# EAGLE design design (EAGLE 9.6.2)
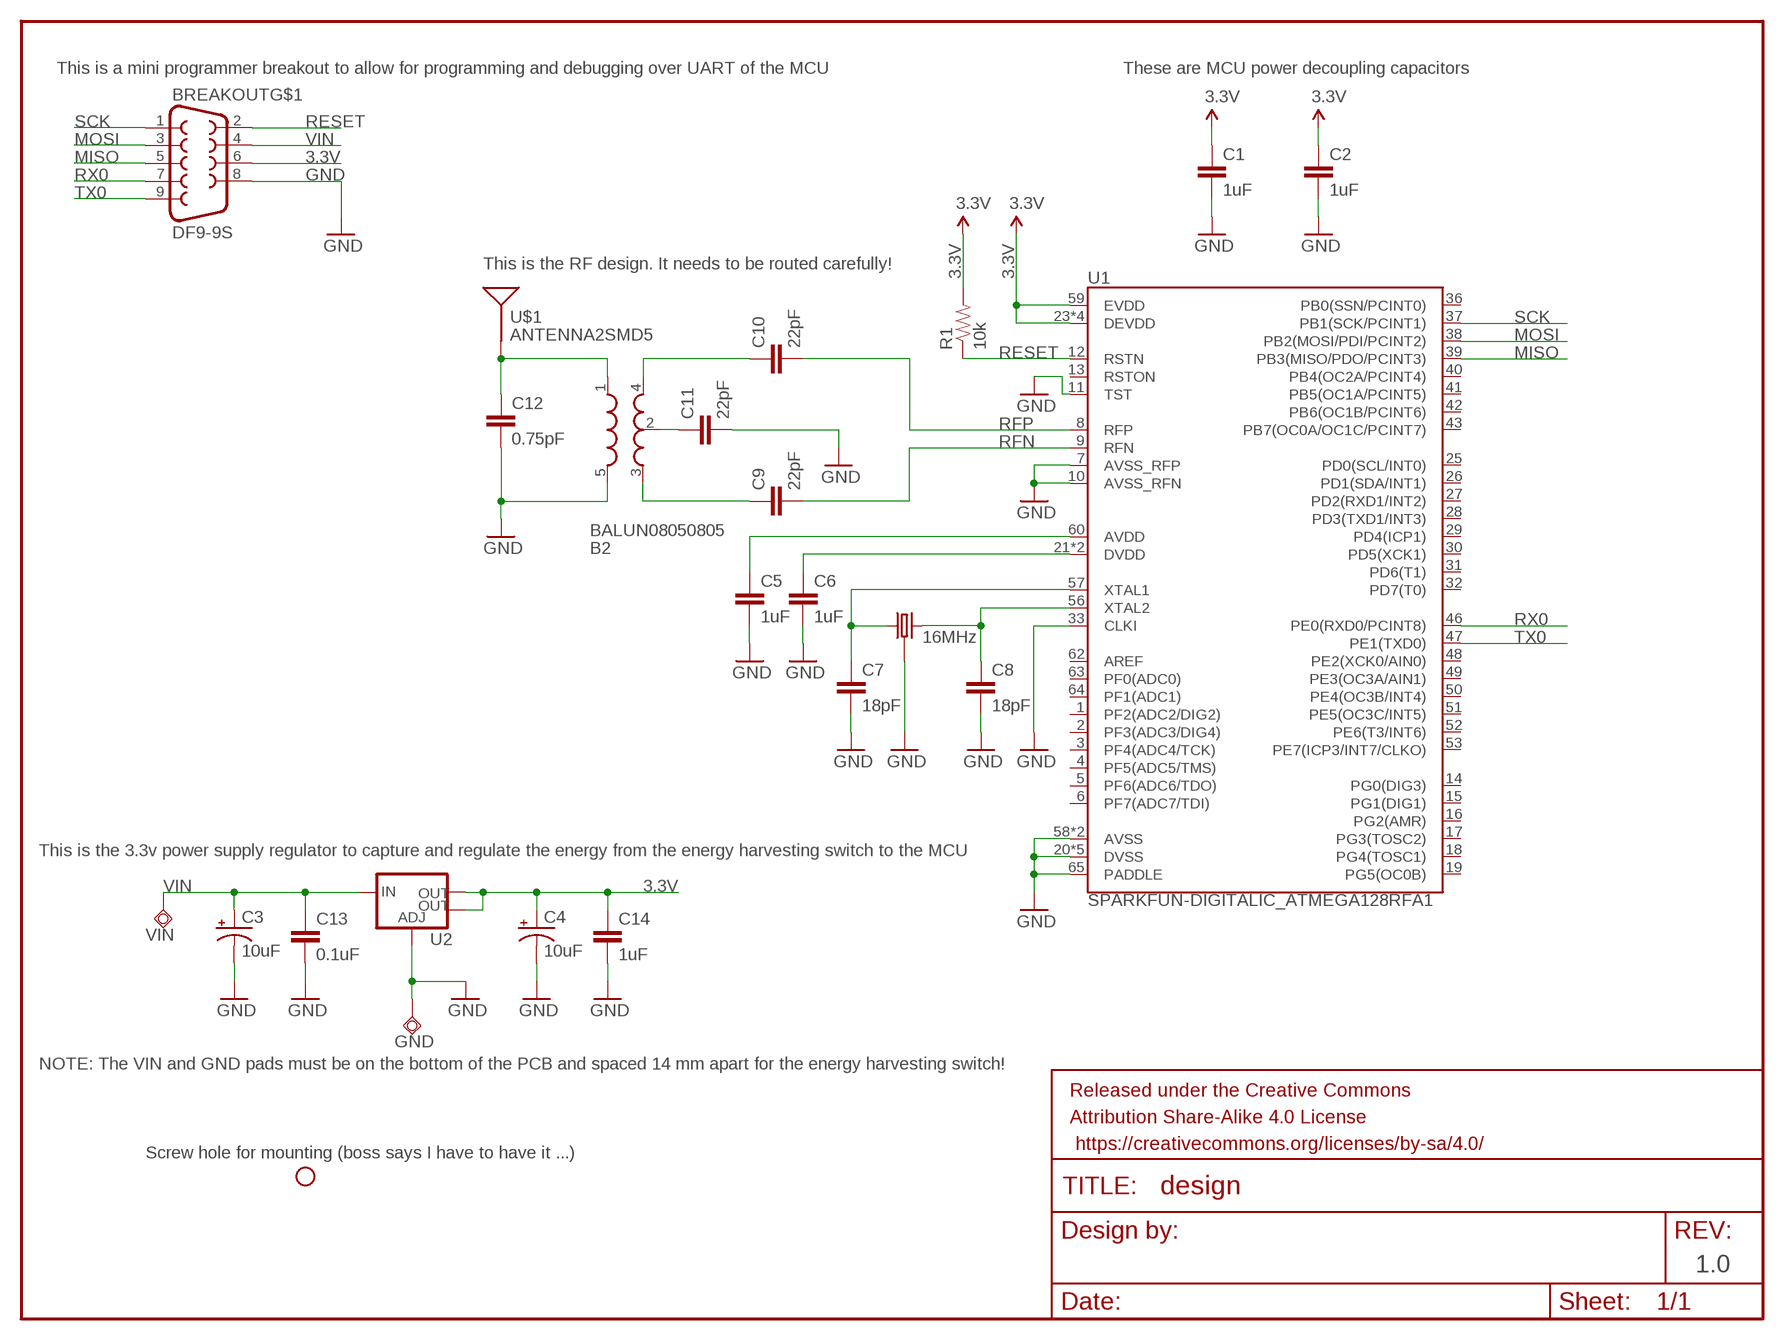
[diagram p0: schematic, sheet 1]

## Parts
B2  BALUN08050805  [BALUN0805]
BREAKOUT  DF9-9S  [DF9-9S]
C1  1uF  CAP0603-CAP  [0603-CAP]
C2  1uF  CAP0603-CAP  [0603-CAP]
C3  10uF  CAP_POL1206  [EIA3216]
C4  10uF  CAP_POL1206  [EIA3216]
C5  1uF  CAP0603-CAP  [0603-CAP]
C6  1uF  CAP0603-CAP  [0603-CAP]
C7  18pF  CAP0603-CAP  [0603-CAP]
C8  18pF  CAP0603-CAP  [0603-CAP]
C9  22pF  C-EUC0402  [C0402]
C10  22pF  C-EUC0402  [C0402]
C11  22pF  CAP0603-CAP  [0603-CAP]
C12  0.75pF  CAP0603-CAP  [0603-CAP]
C13  0.1uF  0.1UF-25V-5%(0603)  [0603-CAP]
C14  1uF  0.1UF-25V-5%(0603)  [0603-CAP]
FRAME1  FRAME-LETTERNO_PACKAGE  [DUMMY]
GND  TPSQTP20SQ  [TP20SQ]
H1  STAND-OFF  [STAND-OFF]
R1  10k  RESISTOR0603-RES  [0603-RES]
U1  SPARKFUN-DIGITALIC_ATMEGA128RFA1  [SPARKFUN-DIGITALIC_QFN-64]
U2  V_REG_LM1117SOT223  [SOT223]
U$1  ANTENNA2SMD5  [ANTENNA-CHIP5]
VIN  TPSQTP20SQ  [TP20SQ]
Y2  16MHz  CRYSTAL5X3.2  [SPARKFUN-FREQCTRL_CRYSTAL-SMD-5X3]

## Nets
3.3V: BREAKOUT.6 C1.1 C2.1 C4.A(+) C14.1 R1.2 U1.23(DEVDD) U1.34(DEVDD) U1.44(DEVDD) U1.54(DEVDD) U1.59(EVDD) U2.2(OUT) U2.4(OUT)
GND: B2.5(GND) BREAKOUT.8 C1.2 C2.2 C3.C(-) C4.C(-) C5.2 C6.2 C7.2 C8.2 C11.2 C12.2 C13.2 C14.2 GND.TP U1.7(AVSS_RFP) U1.10(AVSS_RFN) U1.11(TST) U1.20(DVSS) U1.24(DVSS) U1.33(CLKI) U1.35(DVSS) U1.45(DVSS) U1.55(DVSS) U1.58(AVSS) U1.61(AVSS) U1.65(PADDLE) U2.1(ADJ) Y2.2 Y2.4
MISO: BREAKOUT.5 U1.39(PB3(MISO/PDO/PCINT3))
MOSI: BREAKOUT.3 U1.38(PB2(MOSI/PDI/PCINT2))
N$1: C5.1 U1.60(AVDD)
N$2: C6.1 U1.21(DVDD) U1.22(DVDD)
N$5: C8.1 U1.56(XTAL2) Y2.3
N$8: C7.1 U1.57(XTAL1) Y2.1
N$9: B2.2(GND) C11.1
N$10: B2.3(OUT2) C9.1
N$11: B2.4(OUT1) C10.1
N$12: B2.1(IN) C12.1 U$1.FEED(SIGNAL)
RESET: BREAKOUT.2 R1.1 U1.12(RSTN)
RFN: C9.2 U1.9(RFN)
RFP: C10.2 U1.8(RFP)
RX0: BREAKOUT.7 U1.46(PE0(RXD0/PCINT8))
SCK: BREAKOUT.1 U1.37(PB1(SCK/PCINT1))
TX0: BREAKOUT.9 U1.47(PE1(TXD0))
VIN: BREAKOUT.4 C3.A(+) C13.1 U2.3(IN) VIN.TP
Unconnected: BREAKOUT.M1(X) BREAKOUT.M2(X) U1.1(PF2(ADC2/DIG2)) U1.2(PF3(ADC3/DIG4)) U1.3(PF4(ADC4/TCK)) U1.4(PF5(ADC5/TMS)) U1.5(PF6(ADC6/TDO)) U1.6(PF7(ADC7/TDI)) U1.13(RSTON) U1.14(PG0(DIG3)) U1.15(PG1(DIG1)) U1.16(PG2(AMR)) U1.17(PG3(TOSC2)) U1.18(PG4(TOSC1)) U1.19(PG5(OC0B)) U1.25(PD0(SCL/INT0)) U1.26(PD1(SDA/INT1)) U1.27(PD2(RXD1/INT2)) U1.28(PD3(TXD1/INT3)) U1.29(PD4(ICP1)) U1.30(PD5(XCK1)) U1.31(PD6(T1)) U1.32(PD7(T0)) U1.36(PB0(SSN/PCINT0)) U1.40(PB4(OC2A/PCINT4)) U1.41(PB5(OC1A/PCINT5)) U1.42(PB6(OC1B/PCINT6)) U1.43(PB7(OC0A/OC1C/PCINT7)) U1.48(PE2(XCK0/AIN0)) U1.49(PE3(OC3A/AIN1)) U1.50(PE4(OC3B/INT4)) U1.51(PE5(OC3C/INT5)) U1.52(PE6(T3/INT6)) U1.53(PE7(ICP3/INT7/CLKO)) U1.62(AREF) U1.63(PF0(ADC0)) U1.64(PF1(ADC1))

## Notes on the sheet
- This is a mini programmer breakout to allow for programming and debugging over UART of the MCU | These are MCU power decoupling capacitors
- This is the RF design. It needs to be routed carefully!
- This is the 3.3v power supply regulator to capture and regulate the energy from the energy harvesting switch to the MCU
- NOTE: The VIN and GND pads must be on the bottom of the PCB and spaced 14 mm apart for the energy harvesting switch!
- Screw hole for mounting (boss says I have to have it ...)
- 1.0

## Library data of the parts
B2 = misc:BALUN0805: 0805 footprint balun- Ember 351/357
BREAKOUT = Connectors:DF9-9: Hirose DF9 Series SMD connector 9-pin DF9 Connector; DIGIKEY: H10397TR-ND; GENDER: Receptacle; MPN: DF9-9S-1V(32); PINS: 9
C1 C2 C5-C8 C11 C12 = SparkFun-Passives:CAP: Capacitor Standard 0603 ceramic capacitor, and 0.1" leaded capacitor.
C3 C4 = SparkFun-Capacitors:CAP_POL: Capacitor Polarized These are standard SMD and PTH capacitors. Normally 10uF, 47uF, and 100uF in electrolytic and tantalum varieties. Always verify the external diameter of the through hole cap, it varies with capacity, voltage, and manufacturer. The EIA devices should be standard.
C9 C10 = rcl:C-EU: CAPACITOR, European symbol
C13 = SparkFun-Capacitors:0.1UF-25V-5%(0603): CAP-08604; PROD_ID: CAP-08604
C14 = SparkFun-Capacitors:0.1UF-25V-5%(0603): CAP-08604; PROD_ID: CAP-08604; VALUE: 0.1uF
FRAME1 = SparkFun-Aesthetics:FRAME-LETTER: Schematic Frame Standard 8.5x11 US Letter frame; DESIGNER: Nobody; VERSION: v01
GND VIN = testpad:TPSQ: Test pad
H1 = SparkFun-Electromechanical:STAND-OFF: #4 Stand Off This is the mechanical footprint for a #4 phillips button head screw. Use the keepout ring to avoid running the screw head into surrounding components. SKU : PRT-00447
R1 = SparkFun-Passives:RESISTOR: Resistor Basic schematic elements and footprints for 0603, 1206, and PTH resistors.
U1 = tiles:SPARKFUN-DIGITALIC_ATMEGA128RFA1: ATmega128RFA1 8-bit AVR Microcontroller with Low Power 2.4GHz Transceiver for ZigBee and IEEE 802.15.4
U2 = SparkFun-PowerIC:V_REG_LM1117: Voltage Regulator LM1117 Standard adjustable voltage regulator but in SMD form. Spark Fun Electronics SKU : COM-00595; PROD_ID: VREG-08170
U$1 = SparkFun-RF:ANTENNA2: Chip antenna Single endded antenna. Common with smaller chip antennas. CHIP4 package is the GPS Chip Antenna SKU: GPS-08418. CHIP5 package is 2.4GHz chip antenna SKU: WRL-00144.
Y2 = misc:CRYSTAL

## Board
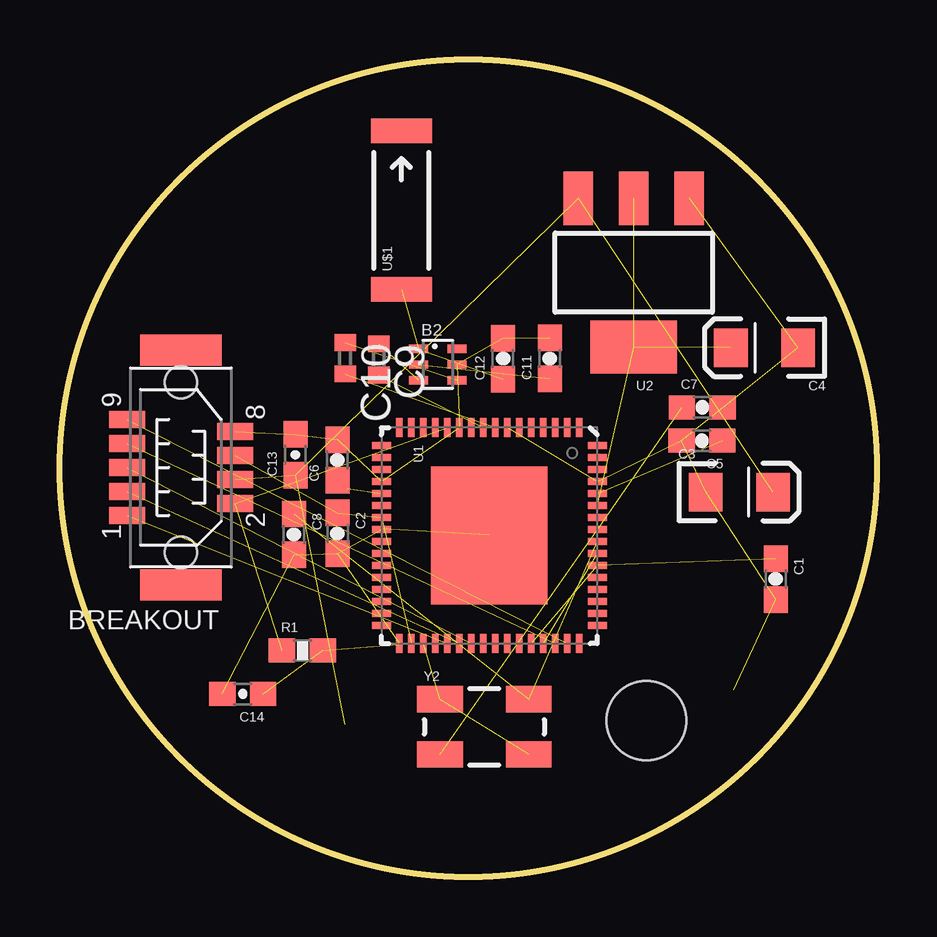
[diagram p1: board, top side]
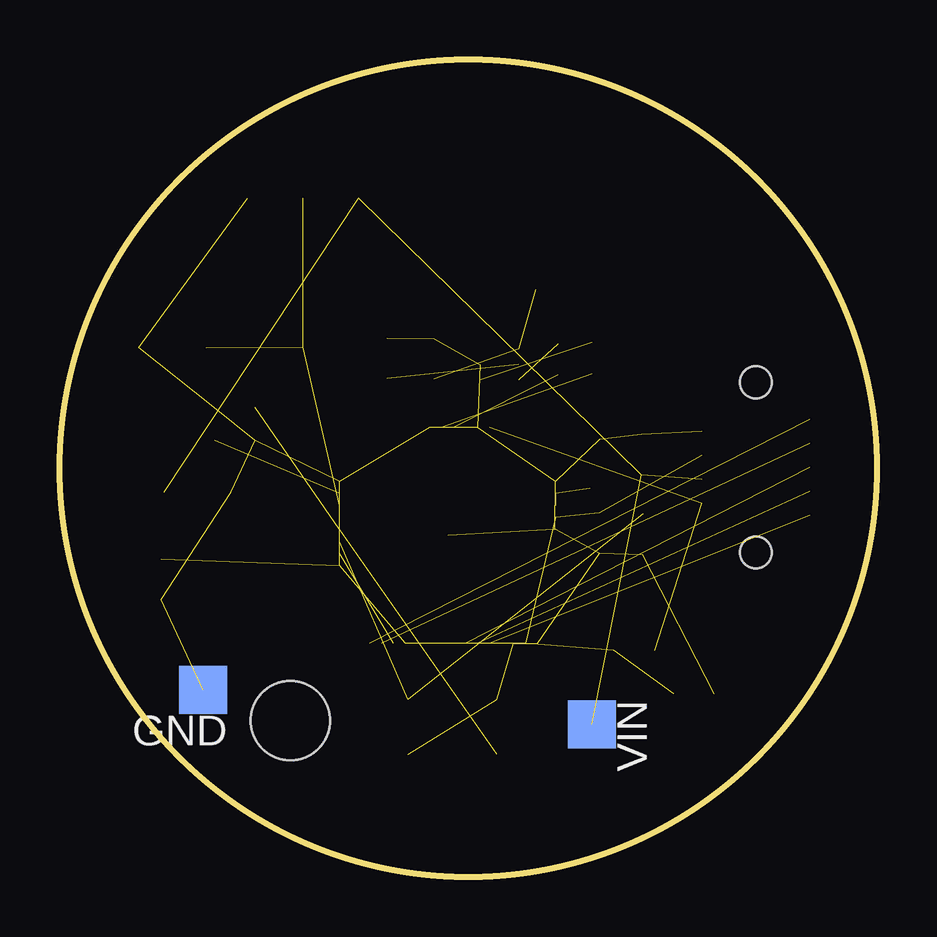
[diagram p2: board, bottom side, seen from below]

Size 34.06 x 34.06 mm. Coordinates in mm from the lower left corner, seen from the top.
Outline: circle at 17.03,17.03 radius 17.03
Copper layers (1*16): Top 0.035mm / dielectric 1.5mm / Bottom 0.035mm
Design rules "default *": minimum track width 10mil, minimum drill 20mil, track to track 8mil, track to pad 8mil, pad to pad 8mil, via to via 8mil, smd to smd 8mil, copper to edge 40mil, drill to drill 8mil, minimum pad ring 10mil, minimum via ring 8mil, stop-mask expansion 4mil, vias tented up to drill 0mil, thermal gap 10mil

### Footprints (pad centres in the part's own frame; a part is rotated, then mirrored left to right if it is on the bottom)
BALUN0805 = smd 0.35 x 0.8: 1 -0.65,-0.8; 2 0,-0.8; 3 0.65,-0.8; 4 0.65,0.8; 5 0,0.8; 6 -0.65,0.8
DF9-9S = smd 0.7 x 1.5: 1 -2,2.25; 2 -1.5,-2.25; 3 -1,2.25; 4 -0.5,-2.25; 5 0,2.25; 6 0.5,-2.25; 7 1,2.25; 8 1.5,-2.25; 9 2,2.25 | smd 1.3 x 3.4: M1 -4.9,0; M2 4.9,0 | hole 1.321: 3.55,0; -3.55,0
0603-CAP = smd 1.1 x 1: 1 -0.85,0; 2 0.85,0
EIA3216 = smd 1.4 x 1.6: A 1.4,0; C -1.4,0
C0402 = smd 0.7 x 0.9: 1 -0.65,0; 2 0.65,0
TP20SQ = smd 2 x 2: TP 0,0
STAND-OFF = hole 3.302: 0,0
0603-RES = smd 1.1 x 1: 1 -0.85,0; 2 0.85,0
SPARKFUN-DIGITALIC_QFN-64 = smd 0.8 x 0.28: 1 -4.5,3.75; 2 -4.5,3.25; 3 -4.5,2.75; 4 -4.5,2.25; 5 -4.5,1.75; 6 -4.5,1.25; 7 -4.5,0.75; 8 -4.5,0.25; 9 -4.5,-0.25; 10 -4.5,-0.75; 11 -4.5,-1.25; 12 -4.5,-1.75; 13 -4.5,-2.25; 14 -4.5,-2.75; 15 -4.5,-3.25; 16 -4.5,-3.75; 33 4.5,-3.75; 34 4.5,-3.25; 35 4.5,-2.75; 36 4.5,-2.25; 37 4.5,-1.75; 38 4.5,-1.25; 39 4.5,-0.75; 40 4.5,-0.25; 41 4.5,0.25; 42 4.5,0.75; 43 4.5,1.25; 44 4.5,1.75; 45 4.5,2.25; 46 4.5,2.75; 47 4.5,3.25; 48 4.5,3.75 | smd 0.28 x 0.8: 17 -3.75,-4.5; 18 -3.25,-4.5; 19 -2.75,-4.5; 20 -2.25,-4.5; 21 -1.75,-4.5; 22 -1.25,-4.5; 23 -0.75,-4.5; 24 -0.25,-4.5; 25 0.25,-4.5; 26 0.75,-4.5; 27 1.25,-4.5; 28 1.75,-4.5; 29 2.25,-4.5; 30 2.75,-4.5; 31 3.25,-4.5; 32 3.75,-4.5; 49 3.75,4.5; 50 3.25,4.5; 51 2.75,4.5; 52 2.25,4.5; 53 1.75,4.5; 54 1.25,4.5; 55 0.75,4.5; 56 0.25,4.5; 57 -0.25,4.5; 58 -0.75,4.5; 59 -1.25,4.5; 60 -1.75,4.5; 61 -2.25,4.5; 62 -2.75,4.5; 63 -3.25,4.5; 64 -3.75,4.5 | smd 5.74 x 4.851: 65 0,0
SOT223 = smd 1.219 x 2.235: 1 -2.311,-3.099; 2 0,-3.099; 3 2.311,-3.099 | smd 3.6 x 2.2: 4 0,3.099
ANTENNA-CHIP5 = smd 1.016 x 2.54: FEED -3.302,0; NC 3.302,0
SPARKFUN-FREQCTRL_CRYSTAL-SMD-5X3 = smd 1.9 x 1.1: 1 -1.85,-1.15; 2 1.85,-1.15; 3 1.85,1.15; 4 -1.85,1.15

### Placement (x,y rotation side)
B2  15.75,21.36 270 top
BREAKOUT  5.04,17.07 90 top
C1  29.84,12.42 270 top
C2  11.57,14.33 270 top
C3  28.32,16.05 0 top
C4  29.37,22.06 180 top
C5  26.77,18.19 180 top
C6  11.57,17.38 90 top
C7  26.78,19.57 0 top
C8  9.75,14.28 270 top
C9  13.29,21.57 270 top
C10  11.89,21.62 270 top
C11  20.42,21.62 90 top
C12  18.47,21.6 90 top
C13  9.82,17.6 90 top
C14  7.62,7.64 180 top
FRAME1  17.24,-2.94 45 top
GND  28.09,7.79 180 bottom
H1  24.45,6.51 0 top
R1  10.11,9.44 0 top
U1  17.9,14.23 270 top
U2  23.92,25.19 180 top
U$1  14.23,27.79 90 top
VIN  11.89,6.37 270 bottom
Y2  17.69,6.26 0 top

### Tracks (layer width: path | path; a pad name or v marks a point on that pad's centre or on a via)
3.3V  (12 unrouted)
  Top 0.254: 29.96,13.39 C1.1 | U1.34 | U1.23 | U1.44
GND  (29 unrouted)
  Top 0.254: U1.24 13.42,14.5 | U1.65 17.89,14.25 | U1.20
MISO  (1 unrouted)
  Top 0.254: U1.39
MOSI  (1 unrouted)
  Top 0.254: U1.38
N$1  (1 unrouted)
N$2  (2 unrouted)
  Top 0.254: U1.22 | U1.21 | 11.97,16.19 11.63,16.53 C6.1
N$5  (2 unrouted)
N$8  (2 unrouted)
  Top 0.254: C7.1 25.94,19.55 | U1.57 22.42,14.5
N$9  (1 unrouted)
  Top 0.254: B2.2 14.93,21.34
N$10  (1 unrouted)
N$11  (1 unrouted)
N$12  (2 unrouted)
RESET  (2 unrouted)
  Top 0.254: U1.12
RFN  (1 unrouted)
  Top 0.254: U1.9
RFP  (1 unrouted)
  Top 0.254: U1.8
RX0  (1 unrouted)
SCK  (1 unrouted)
  Top 0.254: U1.37
TX0  (1 unrouted)
  Top 0.254: U1.47
VIN  (4 unrouted)